# Altium schematic sheet zhili_v1.0.SchDoc
size A2
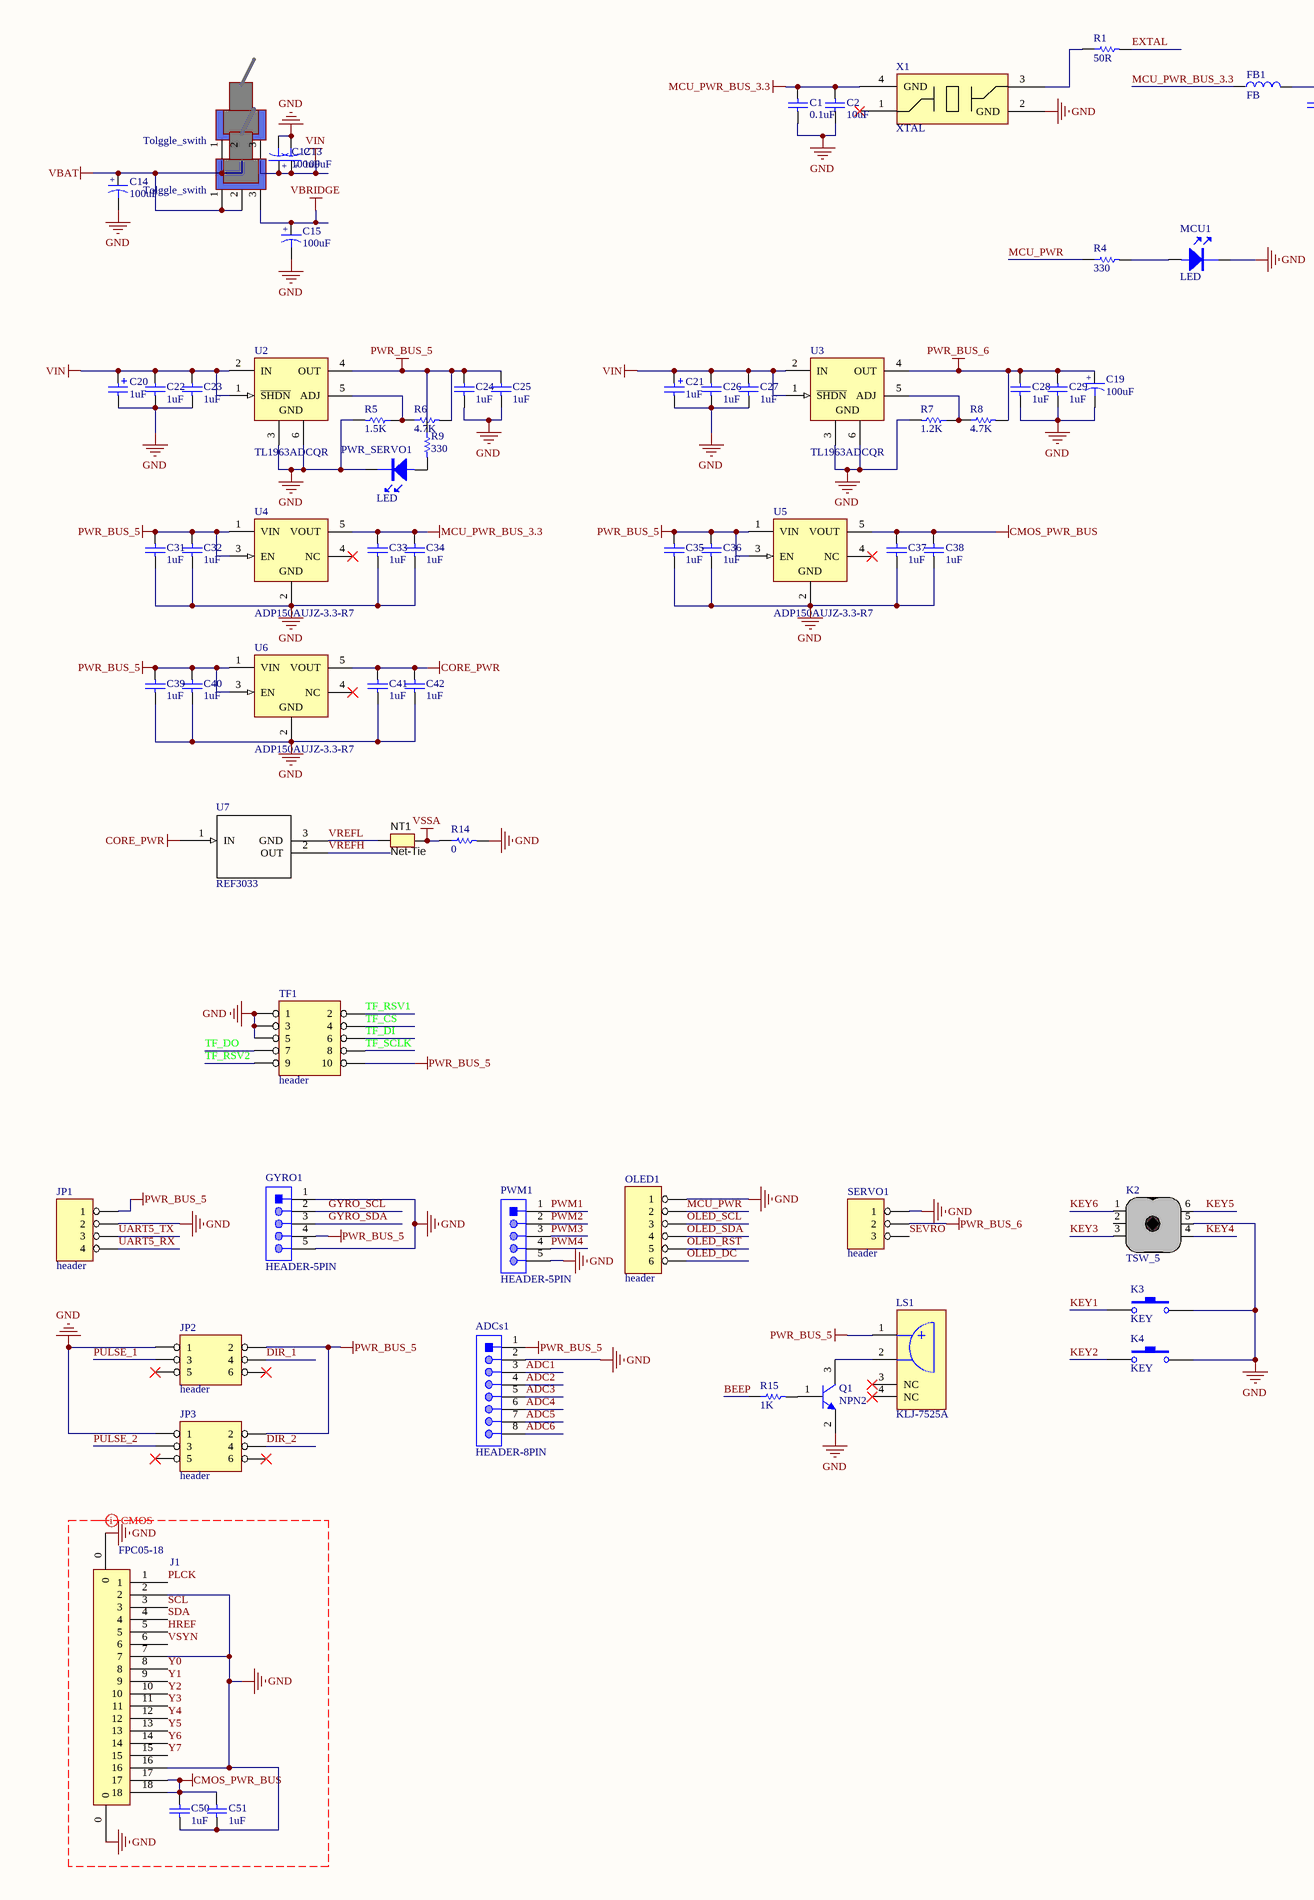
[diagram p0: zhili_v1.0.SchDoc, left]
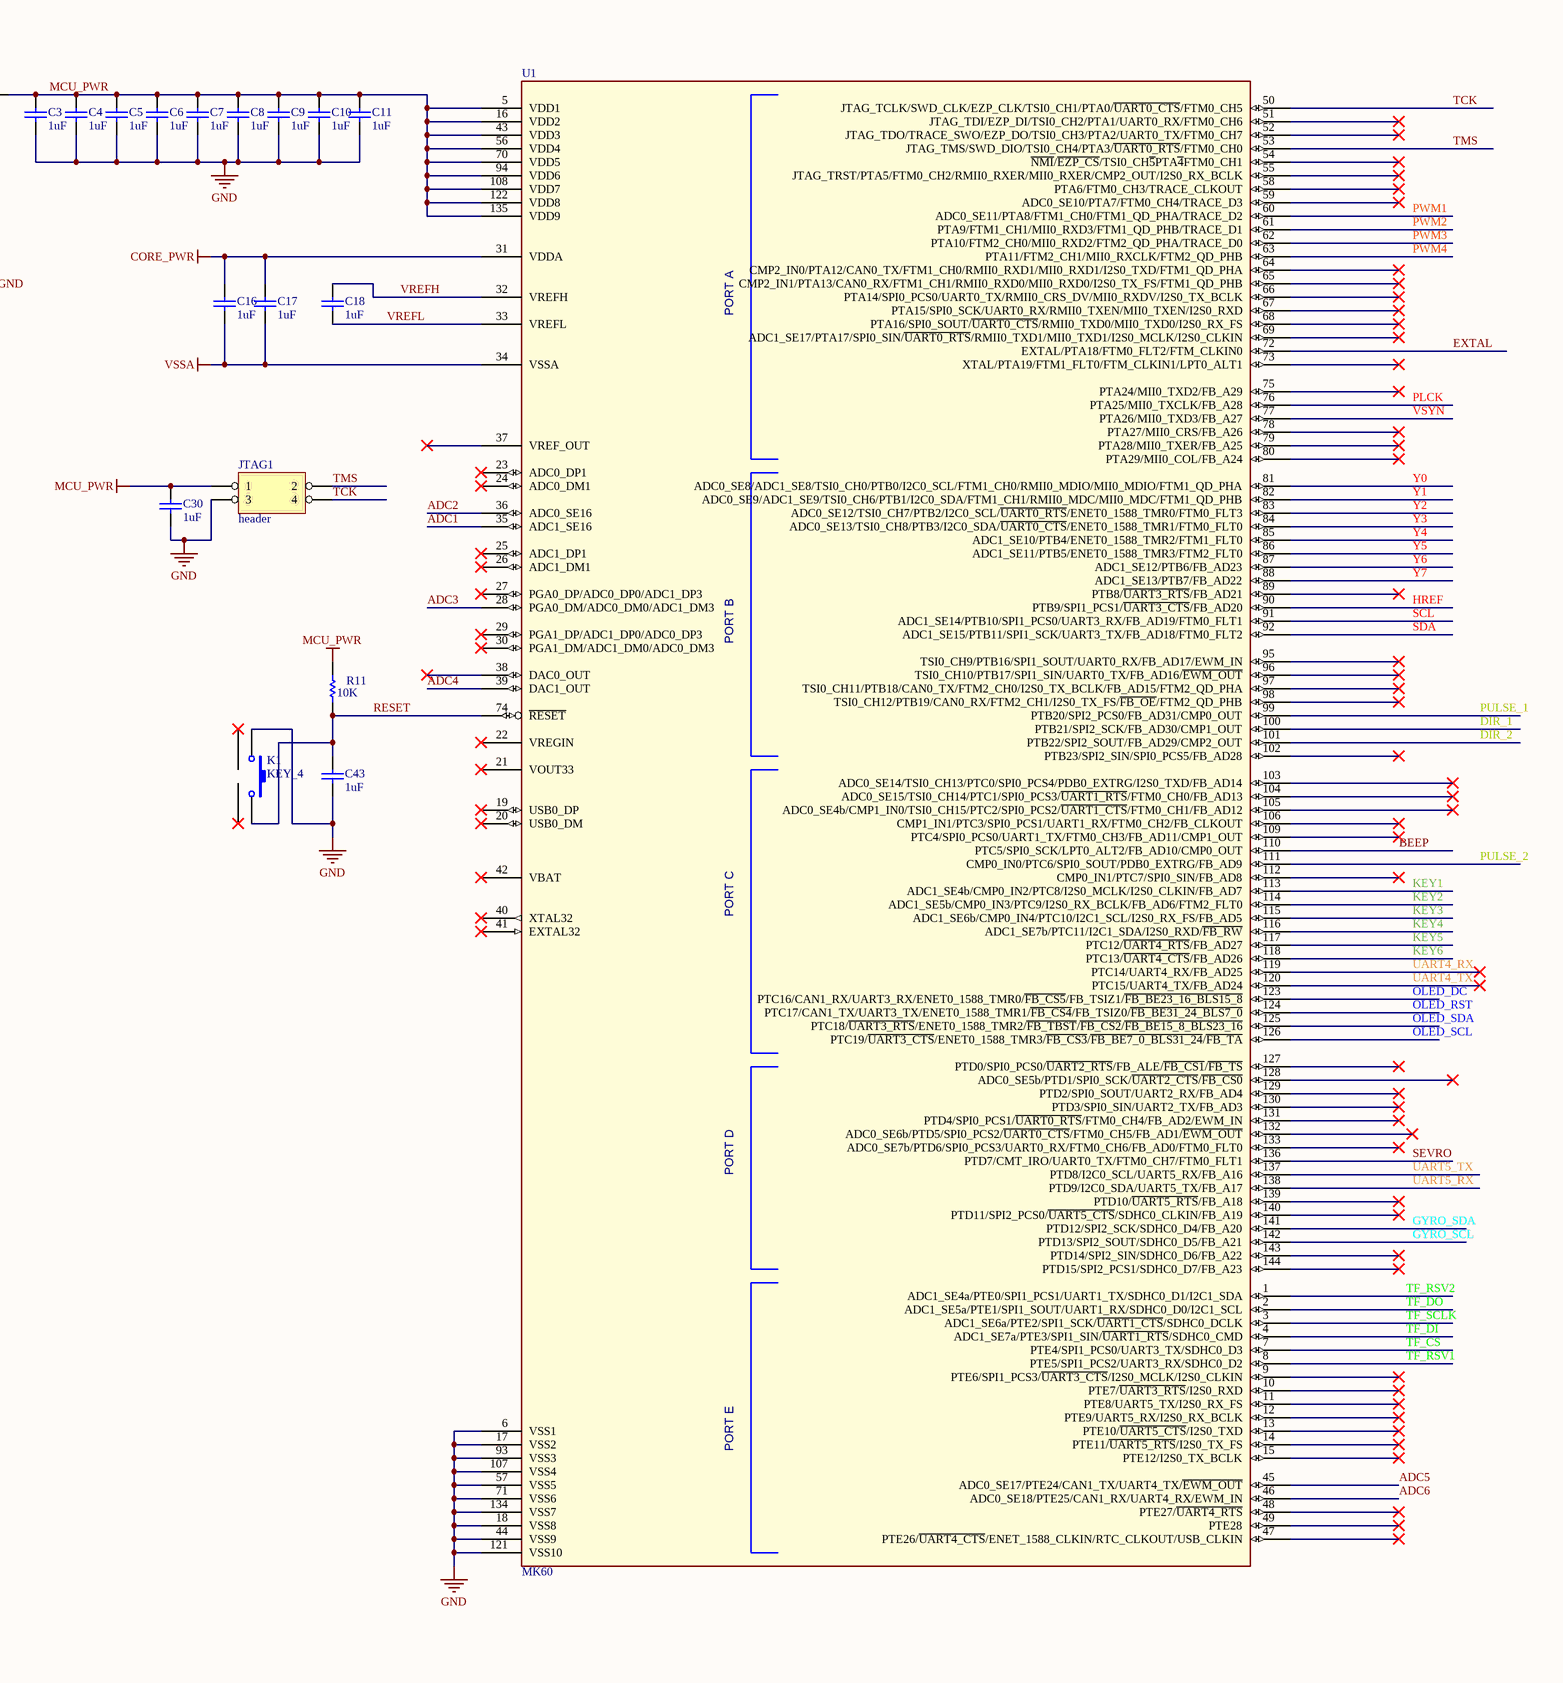
[diagram p1: zhili_v1.0.SchDoc, right]

## Parts
ADCs1  HEADER-8PIN  [HEADER_8P_1.25_RT]
C1  0.1uF  [0603_C]
C2  10uF  [0603_C]
C3  1uF  [0603_C]
C4  1uF  [0603_C]
C5  1uF  [0603_C]
C6  1uF  [0603_C]
C7  1uF  [0603_C]
C8  1uF  [0603_C]
C9  1uF  [0603_C]
C10  1uF  [0603_C]
C11  1uF  [0603_C]
C12  100uF  [C6.3X6.3]
C13  100uF  [C6.3X6.3]
C14  100uF  [CAP 10 x 12]
C15  100uF  [C6.3X6.3]
C16  1uF  [0603_C]
C17  1uF  [0603_C]
C18  1uF  [0603_C]
C19  100uF  [C6.3X6.3]
C20  1uF  [CAPC6032C]
C21  1uF  [CAPC6032C]
C22  1uF  [0603_C]
C23  1uF  [0603_C]
C24  1uF  [0603_C]
C25  1uF  [0603_C]
C26  1uF  [0603_C]
C27  1uF  [0603_C]
C28  1uF  [0603_C]
C29  1uF  [0603_C]
C30  1uF  [0603_C]
C31  1uF  [0805_c]
C32  1uF  [0603_C]
C33  1uF  [0805_c]
C34  1uF  [0603_C]
C35  1uF  [0805_c]
C36  1uF  [0603_C]
C37  1uF  [0805_c]
C38  1uF  [0603_C]
C39  1uF  [0805_c]
C40  1uF  [0603_C]
C41  1uF  [0805_c]
C42  1uF  [0603_C]
C43  1uF  [0603_C]
C50  1uF  [0603_C]
C51  1uF  [0603_C]
DRV1  Tolggle_swith  [TOGGLE SWICH STAND]
FB1  FB  [0805]
GYRO1  HEADER-5PIN  [HEADER_5P_1.25_RT]
J1  FPC05-18  [FPC_18_VER]
JP1  header  [header4]
JP2  header  [header2X3]
JP3  header  [header2X3]
JTAG1  header  [header_2x2_1.27]
K1  KEY_4  [KEY5*5]
K2  TSW_5  [TSW-10]
K3  KEY  [KEY_2]
K4  KEY  [KEY_2]
LS1  KLJ-7525A  [KLJ-7525A_V]
MBD1  Tolggle_swith  [TOGGLE SWICH STAND]
MCU1  LED  [0603_LED]
NT1  Net-Tie  [Net-Tie_10mil]  (net tie, no BOM)
OLED1  header  [0.96寸OLED模块]
PWM1  HEADER-5PIN  [HEADER_5P_1.25_RT]
PWR_SERVO1  LED  [0805_LED]
Q1  NPN2  [SOT-23-3]
R1  50R  [0603_R]
R4  330  [0603_R]
R5  1.5K  [0603_R]
R6  4.7K  [0603_R]
R7  1.2K  [0603_R]
R8  4.7K  [0603_R]
R9  330  [0603_R]
R11  10K  [0603_R]
R14  0  [0603_R]
R15  1K  [0603_R]
SERVO1  header  [header3]
TF1  header  [2002132100010C4LF]
U1  MK60  [LQFP144]
U2  TL1963ADCQR  [DCQ0006A_M]
U3  TL1963ADCQR  [DCQ0006A_M]
U4  ADP150AUJZ-3.3-R7  [ADI-UJ-5_M]
U5  ADP150AUJZ-3.3-R7  [ADI-UJ-5_M]
U6  ADP150AUJZ-3.3-R7  [ADI-UJ-5_M]
U7  REF3033  [SOT-23-3]
X1  XTAL  [OSC_KH3225_4P]

## Nets
CMOS_PWR_BUS: C37.2 C38.2 C50.1 C51.1 J1.17 J1.18 U5.5(VOUT)
CORE_PWR: C16.2 C17.2 C41.2 C42.2 U1.31(VDDA) U6.5(VOUT) U7.1(IN)
GND: ADCs1.2 C1.1 C2.1 C3.1 C4.1 C5.1 C6.1 C7.1 C8.1 C9.1 C10.1 C11.1 C12.2 C13.2 C14.2 C15.2 C19.2 C20.2 C21.2 C22.1 C23.1 C24.1 C25.1 C26.1 C27.1 C28.1 C29.1 C30.2 C31.1 C32.1 C33.1 C34.1 C35.1 C36.1 C37.1 C38.1 C39.1 C40.1 C41.1 C42.1 C43.1 C50.2 C51.2 GYRO1.1 GYRO1.5 J1.0 J1.2 J1.7 J1.16 JP1.2 JP2.1 JP3.1 JTAG1.3 K1.1 K2.5 K3.2 K4.2 MCU1.2(K) OLED1.1 PWM1.5 PWR_SERVO1.2(K) Q1.2(E) R5.2 R7.2 R14.2 SERVO1.1 TF1.1 TF1.3 TF1.5 U1.6(VSS1) U1.17(VSS2) U1.18(VSS8) U1.44(VSS9) U1.57(VSS5) U1.71(VSS6) U1.93(VSS3) U1.107(VSS4) U1.121(VSS10) U1.134(VSS7) U2.3(GND) U2.6(GND) U3.3(GND) U3.6(GND) U4.2(GND) U5.2(GND) U6.2(GND) X1.2(GND)
MCU_PWR: C3.2 C4.2 C5.2 C6.2 C7.2 C8.2 C9.2 C10.2 C11.2 C30.1 FB1.2 JTAG1.1 OLED1.2 R4.1 R11.2 U1.5(VDD1) U1.16(VDD2) U1.43(VDD3) U1.56(VDD4) U1.70(VDD5) U1.94(VDD6) U1.108(VDD7) U1.122(VDD8) U1.135(VDD9)
MCU_PWR_BUS_3.3: C1.2 C2.2 C33.2 C34.2 FB1.1 U4.5(VOUT) X1.4(GND)
PWR_BUS_5: ADCs1.1 C24.2 C25.2 C31.2 C32.2 C35.2 C36.2 C39.2 C40.2 GYRO1.4 JP1.1 JP2.2 JP3.2 LS1.1(A) R6.2 R9.1 TF1.10 U2.4(OUT) U4.1(VIN) U4.3(EN) U5.1(VIN) U5.3(EN) U6.1(VIN) U6.3(EN)
PWR_BUS_6: C19.1 C28.2 C29.2 R8.2 SERVO1.2 U3.4(OUT)
VBAT: C14.1 DRV1.1 DRV1.2 MBD1.1 MBD1.2
VBRIDGE: C15.1 DRV1.3
VIN: C12.1 C13.1 C20.1 C21.1 C22.2 C23.2 C26.2 C27.2 MBD1.3 U2.1(~{SHDN}) U2.2(IN) U3.1(~{SHDN}) U3.2(IN)
VSSA: C16.1 C17.1 NT1.2 R14.1 U1.34(VSSA)
ADC1: ADCs1.3 U1.35(ADC1_SE16)
ADC2: ADCs1.4 U1.36(ADC0_SE16)
ADC3: ADCs1.5 U1.28(PGA0_DM/ADC0_DM0/ADC1_DM3)
ADC4: ADCs1.6 U1.39(DAC1_OUT)
ADC5: ADCs1.7 U1.45(ADC0_SE17/PTE24/CAN1_TX/UART4_TX/~{EWM_OUT})
ADC6: ADCs1.8 U1.46(ADC0_SE18/PTE25/CAN1_RX/UART4_RX/EWM_IN)
BEEP: R15.1 U1.110(PTC5/SPI0_SCK/LPT0_ALT2/FB_AD10/CMP0_OUT)
DIR_1: JP2.4 U1.100(PTB21/SPI2_SCK/FB_AD30/CMP1_OUT)
DIR_2: JP3.4 U1.101(PTB22/SPI2_SOUT/FB_AD29/CMP2_OUT)
EXTAL: R1.2 U1.72(EXTAL/PTA18/FTM0_FLT2/FTM_CLKIN0)
GYRO_SCL: GYRO1.2 U1.142(PTD13/SPI2_SOUT/SDHC0_D5/FB_A21)
GYRO_SDA: GYRO1.3 U1.141(PTD12/SPI2_SCK/SDHC0_D4/FB_A20)
HREF: J1.5 U1.90(PTB9/SPI1_PCS1/~{UART3_CTS}/FB_AD20)
KEY1: K3.1 U1.113(ADC1_SE4b/CMP0_IN2/PTC8/I2S0_MCLK/I2S0_CLKIN/FB_AD7)
KEY2: K4.1 U1.114(ADC1_SE5b/CMP0_IN3/PTC9/I2S0_RX_BCLK/FB_AD6/FTM2_FLT0)
KEY3: K2.3 U1.115(ADC1_SE6b/CMP0_IN4/PTC10/I2C1_SCL/I2S0_RX_FS/FB_AD5)
KEY4: K2.4 U1.116(ADC1_SE7b/PTC11/I2C1_SDA/I2S0_RXD/~{FB_RW})
KEY5: K2.6 U1.117(PTC12/~{UART4_RTS}/FB_AD27)
KEY6: K2.1 U1.118(PTC13/~{UART4_CTS}/FB_AD26)
OLED_DC: OLED1.6 U1.123(PTC16/CAN1_RX/UART3_RX/ENET0_1588_TMR0/~{FB_CS5}/FB_TSIZ1/~{FB_BE23_16_BLS15_8})
OLED_RST: OLED1.5 U1.124(PTC17/CAN1_TX/UART3_TX/ENET0_1588_TMR1/~{FB_CS4}/FB_TSIZ0/~{FB_BE31_24_BLS7_0})
OLED_SCL: OLED1.3 U1.126(PTC19/~{UART3_CTS}/ENET0_1588_TMR3/~{FB_CS3}/~{FB_BE7_0_BLS31_24}/~{FB_TA})
OLED_SDA: OLED1.4 U1.125(PTC18/~{UART3_RTS}/ENET0_1588_TMR2/~{FB_TBST}/~{FB_CS2}/~{FB_BE15_8_BLS23_16})
PLCK: J1.1 U1.76(PTA25/MII0_TXCLK/FB_A28)
PULSE_1: JP2.3 U1.99(PTB20/SPI2_PCS0/FB_AD31/CMP0_OUT)
PULSE_2: JP3.3 U1.111(CMP0_IN0/PTC6/SPI0_SOUT/PDB0_EXTRG/FB_AD9)
PWM1: PWM1.1 U1.60(ADC0_SE11/PTA8/FTM1_CH0/FTM1_QD_PHA/TRACE_D2)
PWM2: PWM1.2 U1.61(PTA9/FTM1_CH1/MII0_RXD3/FTM1_QD_PHB/TRACE_D1)
PWM3: PWM1.3 U1.62(PTA10/FTM2_CH0/MII0_RXD2/FTM2_QD_PHA/TRACE_D0)
PWM4: PWM1.4 U1.63(PTA11/FTM2_CH1/MII0_RXCLK/FTM2_QD_PHB)
RESET: C43.2 K1.2 R11.1 U1.74(~{RESET})
SCL: J1.3 U1.91(ADC1_SE14/PTB10/SPI1_PCS0/UART3_RX/FB_AD19/FTM0_FLT1)
SDA: J1.4 U1.92(ADC1_SE15/PTB11/SPI1_SCK/UART3_TX/FB_AD18/FTM0_FLT2)
SEVRO: SERVO1.3 U1.136(PTD7/CMT_IRO/UART0_TX/FTM0_CH7/FTM0_FLT1)
TCK: JTAG1.4 U1.50(JTAG_TCLK/SWD_CLK/EZP_CLK/TSI0_CH1/PTA0/~{UART0_CTS}/FTM0_CH5)
TF_CS: TF1.4 U1.7(PTE4/SPI1_PCS0/UART3_TX/SDHC0_D3)
TF_DI: TF1.6 U1.4(ADC1_SE7a/PTE3/SPI1_SIN/~{UART1_RTS}/SDHC0_CMD)
TF_DO: TF1.7 U1.2(ADC1_SE5a/PTE1/SPI1_SOUT/UART1_RX/SDHC0_D0/I2C1_SCL)
TF_RSV1: TF1.2 U1.8(PTE5/SPI1_PCS2/UART3_RX/SDHC0_D2)
TF_RSV2: TF1.9 U1.1(ADC1_SE4a/PTE0/SPI1_PCS1/UART1_TX/SDHC0_D1/I2C1_SDA)
TF_SCLK: TF1.8 U1.3(ADC1_SE6a/PTE2/SPI1_SCK/~{UART1_CTS}/SDHC0_DCLK)
TMS: JTAG1.2 U1.53(JTAG_TMS/SWD_DIO/TSI0_CH4/PTA3/~{UART0_RTS}/FTM0_CH0)
UART4_RX: U1.119(PTC14/UART4_RX/FB_AD25)
UART4_TX: U1.120(PTC15/UART4_TX/FB_AD24)
UART5_RX: JP1.4 U1.138(PTD9/I2C0_SDA/UART5_TX/FB_A17)
UART5_TX: JP1.3 U1.137(PTD8/I2C0_SCL/UART5_RX/FB_A16)
VREFH: C18.2 U1.32(VREFH) U7.2(OUT)
VREFL: C18.1 NT1.1 U1.33(VREFL) U7.3(GND)
VSYN: J1.6 U1.77(PTA26/MII0_TXD3/FB_A27)
Y0: J1.8 U1.81(ADC0_SE8/ADC1_SE8/TSI0_CH0/PTB0/I2C0_SCL/FTM1_CH0/RMII0_MDIO/MII0_MDIO/FTM1_QD_PHA)
Y1: J1.9 U1.82(ADC0_SE9/ADC1_SE9/TSI0_CH6/PTB1/I2C0_SDA/FTM1_CH1/RMII0_MDC/MII0_MDC/FTM1_QD_PHB)
Y2: J1.10 U1.83(ADC0_SE12/TSI0_CH7/PTB2/I2C0_SCL/~{UART0_RTS}/ENET0_1588_TMR0/FTM0_FLT3)
Y3: J1.11 U1.84(ADC0_SE13/TSI0_CH8/PTB3/I2C0_SDA/~{UART0_CTS}/ENET0_1588_TMR1/FTM0_FLT0)
Y4: J1.12 U1.85(ADC1_SE10/PTB4/ENET0_1588_TMR2/FTM1_FLT0)
Y5: J1.13 U1.86(ADC1_SE11/PTB5/ENET0_1588_TMR3/FTM2_FLT0)
Y6: J1.14 U1.87(ADC1_SE12/PTB6/FB_AD23)
Y7: J1.15 U1.88(ADC1_SE13/PTB7/FB_AD22)
NetLS1_2: LS1.2(K) Q1.3(C)
NetMCU1_1: MCU1.1(A) R4.2
NetPWR_SERVO1_1: PWR_SERVO1.1(A) R9.2
NetQ1_1: Q1.1(B) R15.2
NetR1_1: R1.1 X1.3(OSC2)
NetR5_1: R5.1 R6.1 U2.5(ADJ)
NetR7_1: R7.1 R8.1 U3.5(ADJ)

Not connected (* = marked no-connect by the designer): JP2 5* 6*; JP3 5* 6*; K1 3* 4*; K2 2; LS1 3(NC)* 4(NC)*; U1 9(PTE6/SPI1_PCS3/~{UART3_CTS}/I2S0_MCLK/I2S0_CLKIN)* 10(PTE7/~{UART3_RTS}/I2S0_RXD)* 11(PTE8/UART5_TX/I2S0_RX_FS)* 12(PTE9/UART5_RX/I2S0_RX_BCLK)* 13(PTE10/~{UART5_CTS}/I2S0_TXD)* 14(PTE11/~{UART5_RTS}/I2S0_TX_FS)* 15(PTE12/I2S0_TX_BCLK)* 19(USB0_DP)* 20(USB0_DM)* 21(VOUT33)* 22(VREGIN)* 23(ADC0_DP1)* 24(ADC0_DM1)* 25(ADC1_DP1)* 26(ADC1_DM1)* 27(PGA0_DP/ADC0_DP0/ADC1_DP3)* 29(PGA1_DP/ADC1_DP0/ADC0_DP3)* 30(PGA1_DM/ADC1_DM0/ADC0_DM3)* 37(VREF_OUT)* 38(DAC0_OUT)* 40(XTAL32)* 41(EXTAL32)* 42(VBAT)* 47(PTE26/~{UART4_CTS}/ENET_1588_CLKIN/RTC_CLKOUT/USB_CLKIN)* 48(PTE27/~{UART4_RTS})* 49(PTE28)* 51(JTAG_TDI/EZP_DI/TSI0_CH2/PTA1/UART0_RX/FTM0_CH6)* 52(JTAG_TDO/TRACE_SWO/EZP_DO/TSI0_CH3/PTA2/UART0_TX/FTM0_CH7)* 54(~{NMI}/~{EZP_CS}/TSI0_CH~{5}PTA~{4}FTM0_CH1)* 55(JTAG_TRST/PTA5/FTM0_CH2/RMII0_RXER/MII0_RXER/CMP2_OUT/I2S0_RX_BCLK)* 58(PTA6/FTM0_CH3/TRACE_CLKOUT)* 59(ADC0_SE10/PTA7/FTM0_CH4/TRACE_D3)* 64(CMP2_IN0/PTA12/CAN0_TX/FTM1_CH0/RMII0_RXD1/MII0_RXD1/I2S0_TXD/FTM1_QD_PHA)* 65(CMP2_IN1/PTA13/CAN0_RX/FTM1_CH1/RMII0_RXD0/MII0_RXD0/I2S0_TX_FS/FTM1_QD_PHB)* 66(PTA14/SPI0_PCS0/UART0_TX/RMII0_CRS_DV/MII0_RXDV/I2S0_TX_BCLK)* 67(PTA15/SPI0_SCK/UART0_RX/RMII0_TXEN/MII0_TXEN/I2S0_RXD)* 68(PTA16/SPI0_SOUT/~{UART0_CTS}/RMII0_TXD0/MII0_TXD0/I2S0_RX_FS)* 69(ADC1_SE17/PTA17/SPI0_SIN/~{UART0_RTS}/RMII0_TXD1/MII0_TXD1/I2S0_MCLK/I2S0_CLKIN)* 73(XTAL/PTA19/FTM1_FLT0/FTM_CLKIN1/LPT0_ALT1)* 75(PTA24/MII0_TXD2/FB_A29)* 78(PTA27/MII0_CRS/FB_A26)* 79(PTA28/MII0_TXER/FB_A25)* 80(PTA29/MII0_COL/FB_A24)* 89(PTB8/~{UART3_RTS}/FB_AD21)* 95(TSI0_CH9/PTB16/SPI1_SOUT/UART0_RX/FB_AD17/EWM_IN)* 96(TSI0_CH10/PTB17/SPI1_SIN/UART0_TX/FB_AD16/~{EWM_OUT})* 97(TSI0_CH11/PTB18/CAN0_TX/FTM2_CH0/I2S0_TX_BCLK/FB_AD15/FTM2_QD_PHA)* 98(TSI0_CH12/PTB19/CAN0_RX/FTM2_CH1/I2S0_TX_FS/~{FB_OE}/FTM2_QD_PHB)* 102(PTB23/SPI2_SIN/SPI0_PCS5/FB_AD28)* 103(ADC0_SE14/TSI0_CH13/PTC0/SPI0_PCS4/PDB0_EXTRG/I2S0_TXD/FB_AD14)* 104(ADC0_SE15/TSI0_CH14/PTC1/SPI0_PCS3/~{UART1_RTS}/FTM0_CH0/FB_AD13)* 105(ADC0_SE4b/CMP1_IN0/TSI0_CH15/PTC2/SPI0_PCS2/~{UART1_CTS}/FTM0_CH1/FB_AD12)* 106(CMP1_IN1/PTC3/SPI0_PCS1/UART1_RX/FTM0_CH2/FB_CLKOUT)* 109(PTC4/SPI0_PCS0/UART1_TX/FTM0_CH3/FB_AD11/CMP1_OUT)* 112(CMP0_IN1/PTC7/SPI0_SIN/FB_AD8)* 127(PTD0/SPI0_PCS0/~{UART2_RTS}/FB_ALE/~{FB_CS1}/~{FB_TS})* 128(ADC0_SE5b/PTD1/SPI0_SCK/~{UART2_CTS}/~{FB_CS0})* 129(PTD2/SPI0_SOUT/UART2_RX/FB_AD4)* 130(PTD3/SPI0_SIN/UART2_TX/FB_AD3)* 131(PTD4/SPI0_PCS1/~{UART0_RTS}/FTM0_CH4/FB_AD2/EWM_IN)* 132(ADC0_SE6b/PTD5/SPI0_PCS2/~{UART0_CTS}/FTM0_CH5/FB_AD1/~{EWM_OUT})* 133(ADC0_SE7b/PTD6/SPI0_PCS3/UART0_RX/FTM0_CH6/FB_AD0/FTM0_FLT0)* 139(PTD10/~{UART5_RTS}/FB_A18)* 140(PTD11/SPI2_PCS0/~{UART5_CTS}/SDHC0_CLKIN/FB_A19)* 143(PTD14/SPI2_SIN/SDHC0_D6/FB_A22)* 144(PTD15/SPI2_PCS1/SDHC0_D7/FB_A23)*; U4 4(NC)*; U5 4(NC)*; U6 4(NC)*; X1 1(OSC1)*

## Layout directives
net class CL_CMOS; rule Clearance Constraint [Generic clearance = 6mil, and 9 value(s) for objects]; rule Routing Via Style [Pref Size = 20mil    Pref Hole Size = 12mil]; rule Polygon Connect Style [Style - Direct Connect]: CMOS_PWR_BUS, GND, HREF, PLCK, SCL, SDA, VSYN, Y0, Y1, Y2, Y3, Y4, Y5, Y6, Y7

## Notes on the sheet
- (in symbol Cap_polar) +
- (in symbol MK60) PORT A; PORT B; PORT C; PORT D; PORT E

## Library data of the parts
C1-C11 C16-C18 C22-C43 C50 C51 = CAP: Capacitor; Value: 104; Published: 8-Jun-2000; LatestRevisionDate: 17-Jul-2002; LatestRevisionNote: Re-released for DXP Platform.; PackageReference: RAD-0.3; Publisher: Altium Limited
C12-C15 C19 = Cap_polar
C20 C21 = CAP_tan: Capacitor; Value: 104; Published: 8-Jun-2000; LatestRevisionDate: 17-Jul-2002; LatestRevisionNote: Re-released for DXP Platform.; PackageReference: RAD-0.3; Publisher: Altium Limited
FB1 = FB: 磁珠
JP1 = HEADER 4
JP2 JP3 = HEADER 3X2
JTAG1 = HEADER 2X2
K1 = KEY_4: Switch; Published: 24-Mar-1999; LatestRevisionDate: 17-Jul-2002; LatestRevisionNote: Re-released for DXP Platform.; PackageReference: SPST-2; Publisher: Altium Limited
K2 = TSW_5: 方向开关
K3 K4 = KEY_2: Switch; Published: 24-Mar-1999; LatestRevisionDate: 17-Jul-2002; LatestRevisionNote: Re-released for DXP Platform.; PackageReference: SPST-2; Publisher: Altium Limited
LS1 = CMP-0642-00001-1: Buzzer, 2731 Hz, 16 Ohm, 85 dB, 90 mA, 2.5 to 4.5 V, -20 to 60 degC, 7.5 x 7.5 x 2.5 mm SMD, RoHS, Tape and Reel; Manufacturer: KaiLiJin; Current Consumption (Max.): 90 mA at Rated Voltage; Oscillation Frequency: 2731 Hz; Sound Pressure Level at 10 cm at Rated Voltage (Min.): 85 dB; Coil Resistance: 13 to 19 Ohm; Rated Voltage: 3.6 V; PartNumber: KLJ-7525A; Operating Temperature: -20 to 60 degC; Packing: Tape and Reel; RoHS: TRUE; PackageReference: KLJ-7525A; ComponentLink1Description: Manufacturer URL; ComponentLink2Description: Datasheet; PackageDescription: SMD, Body 7.5 x 7.5 mm, Pitch 6.2 mm; Mounting Technology: Surface Mount; Operating Voltage: 2.5 to 4.5 V; ComponentLink1URL: http://kailijin.cn/; ComponentLink2URL: http://kailijin.cn/en/view.asp?ClassLayer=59
MCU1 PWR_SERVO1 = LED: LED 发光二极管
NT1 = Net-Tie: Single point connection between nets.; SymbolCreator: codlsc; SymbolVersion: 2009-07-01; MountType: SMT; Publisher: Texas Instruments; LatestRevisionDate: 2015-10-18; LatestRevisionNote: Added Alternate PartNumber and Alternate Manufacturer parameters to appropriate components.; PackageReference: N/A
OLED1 = HEADER 6
Q1 = NPN2: 贴片
R1 R4-R9 R11 R14 = RES: Resistor; Value: 1K; Published: 8-Jun-2000; Revision: July-2002: Re-released for DXP Platform.; Publisher: Altium Limited
R15 = RES: Resistor; Published: 8-Jun-2000; Revision: July-2002: Re-released for DXP Platform.; Publisher: Altium Limited; Value: 1K
SERVO1 = HEADER 3
TF1 = HEADER 5X2
U2 U3 = CMP-0395-00366-2: Single Output Fast Transient Response LDO, 1.5 A, Adjustable 1.21 to 20 V Output, 2.1 to 20 V Input, 6-pin SOT-223 (DCQ), -40 to 125 degC, Green (RoHS & no Sb/Br); Manufacturer: Texas Instruments; Iout(Max)(A): 1.5; Vout Adj(Min)(V): 1.21; Vin(Min)(V): 2.1; SubFamily: Single Channel LDO; Vout Adj(Max)(V): 20; Vdo(Typ)(mV): 340; Iq(Typ)(mA): 1; PackageVersion: 4202109/D; ComponentLink3URL: http://www.ti.com/litv/pdf/mpds098c; ComponentLink2Description: Datasheet; PartNumber: TL1963ADCQR; Eco-Plan: Green (RoHS & no Sb/Br); Mounting Technology: Surface Mount; PackageReference: DCQ0006A; DatasheetVersion: SLVS719F; ComponentLink1URL: http://www.ti.com/; ComponentLink3Description: Package Specification; ComponentLink2URL: http://www.ti.com/general/docs/lit/getliterature.tsp?genericPartNumber=TL1963A&fileType=pdf; Vin(Max)(V): 20; ComponentLink1Description: Manufacturer URL; PackageDescription: 6-Pin Plastic Small Outline, Body 3.5 x 6.5 mm, Pitch 1.27 mm
U4-U6 = CMP-0786-00394-1: Ultralow Noise, 150 mA CMOS Linear Regulator, 2.2 to 5.5 V Vin, 3.3 V Vout, Industrial, 5-pin SOT23 (UJ-5), Reel; Manufacturer: Analog Devices; Supply Current IGND @ Small Load: 10uA; Vin (min) (V): 2.2; Iout max: 150mA; Preset Vout Values (V): 3.3; Vin (max) (V): 5.5; ComponentLink2Description: Datasheet; PackageReference: UJ-5; DatasheetVersion: Rev. A; PackageDescription: 5-Pin Thin Small Outline Transistor Package, Body 2.9 x 1.6 mm, Pitch 0.95 mm; ComponentLink4URL: Product URL:http://www.analog.com/en/ADP150/productSearch.html; Packing: Reel; ComponentLink1URL: http://www.analog.com/en/index.html; PartNumber: ADP150AUJZ-3.3-R7; PackageVersion: 100708-A, 10/2008; ComponentLink3Description: Package Specification; ComponentLink3URL: http:/www.analog.com/static/imported-files/packages/PKG_PDF/TSOT(UJ)/UJ_5.pdf; ComponentLink4Description: URL Link1; ComponentLink2URL: http://www.analog.com/static/imported-files/data_sheets/ADP150.pdf; Code_JEDEC: MO-193-AB; Mounting Technology: Surface Mount; ComponentLink1Description: Manufacturer URL
U7 = REF3033_DBZ_3: Imported; Manufacturer: Texas Instruments; INDUSTRY_STD_PKG_TYPE: SOT-23; FAMILY_NAME: SERIES VOLTAGE REFERENCE; PIN_COUNT: 3; PACKAGE_DESIGNATOR: DBZ; Datasheet URL: http://www.ti.com/lit/gpn/REF3033; GENERIC_PART_NUMBER: REF3033; Vendor: Texas Instruments; Manufacturer_Part_Number: ref3033_dbz_3; RefDes: RefDes; Type: DEV; Value: Value
X1 = XTAL_贴片